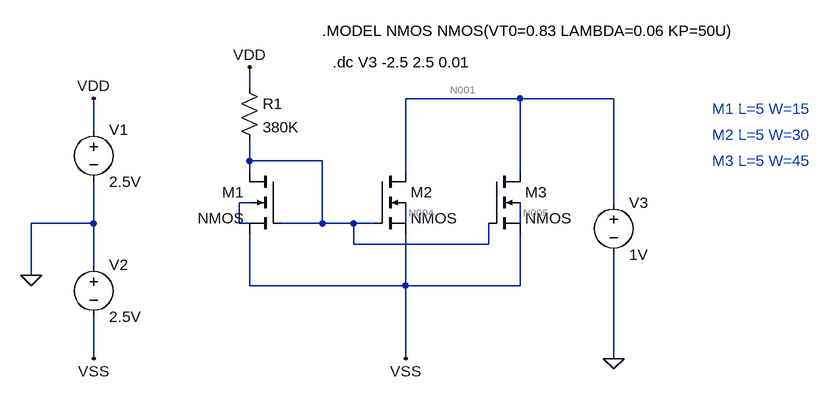
[diagram p0: schematic Cascaded.asc]
Cascaded.asc, the LTspice schematic file:
Version 4
SHEET 1 880 680
WIRE -16 -16 -16 -48
WIRE 400 0 224 0
WIRE 544 0 400 0
WIRE -256 48 -256 0
WIRE -16 96 -16 64
WIRE 96 96 -16 96
WIRE -16 112 -16 96
WIRE 224 112 224 0
WIRE 400 112 400 0
WIRE -16 160 -32 160
WIRE 544 160 544 0
WIRE -256 192 -256 128
WIRE -256 192 -352 192
WIRE -32 192 -32 160
WIRE -16 192 -32 192
WIRE 96 192 96 96
WIRE 96 192 32 192
WIRE 144 192 96 192
WIRE 176 192 144 192
WIRE 224 192 224 160
WIRE 400 192 400 160
WIRE 144 224 144 192
WIRE 352 224 352 192
WIRE 352 224 144 224
WIRE -256 256 -256 192
WIRE -352 272 -352 192
WIRE -16 288 -16 208
WIRE 224 288 224 208
WIRE 224 288 -16 288
WIRE 400 288 400 208
WIRE 400 288 224 288
WIRE -256 400 -256 336
WIRE 224 400 224 288
WIRE 544 400 544 240
FLAG -352 272 0
FLAG 544 400 0
FLAG -256 0 VDD
FLAG -16 -48 VDD
FLAG -256 400 VSS
FLAG 224 400 VSS
SYMBOL nmos4 352 112 R0
SYMATTR InstName M3
SYMATTR Value2 l=5 w=45
SYMBOL nmos4 32 112 M0
SYMATTR InstName M1
SYMATTR Value2 l=5 w=15
SYMBOL voltage -256 32 R0
WINDOW 123 0 0 Left 2
WINDOW 39 0 0 Left 2
SYMATTR InstName V1
SYMATTR Value 2.5V
SYMBOL voltage -256 240 R0
WINDOW 123 0 0 Left 2
WINDOW 39 0 0 Left 2
SYMATTR InstName V2
SYMATTR Value 2.5V
SYMBOL voltage 544 144 R0
WINDOW 123 0 0 Left 2
WINDOW 39 0 0 Left 2
SYMATTR InstName V3
SYMATTR Value 1V
SYMBOL res -32 -32 R0
SYMATTR InstName R1
SYMATTR Value 380K
SYMBOL nmos4 176 112 R0
SYMATTR InstName M2
SYMATTR Value2 l=5 w=30
TEXT 96 -104 Left 2 !.MODEL NMOS NMOS(VT0=0.83 LAMBDA=0.06 KP=50U)
TEXT 112 -56 Left 2 !.dc V3 -2.5 2.5 0.01
TEXT 696 16 Left 2 ;M1 L=5 W=15
TEXT 696 56 Left 2 ;M2 L=5 W=30
TEXT 696 96 Left 2 ;M3 L=5 W=45

The netlist it stands for:
* Cascaded.asc
M3 N001 N002 VSS N005 NMOS l=5 w=45
M1 N002 N002 VSS N003 NMOS l=5 w=15
V1 VDD 0 2.5V
V2 0 VSS 2.5V
V3 N001 0 1V
R1 VDD N002 380K
M2 N001 N002 VSS N004 NMOS l=5 w=30
.model NMOS NMOS
.model PMOS PMOS
.lib standard.mos
.MODEL NMOS NMOS(VT0=0.83 LAMBDA=0.06 KP=50U)
.dc V3 -2.5 2.5 0.01
* M1 L=5 W=15
* M2 L=5 W=30
* M3 L=5 W=45
.backanno
.end

* Results of the author's LTspice run, read from the files saved beside the schematic
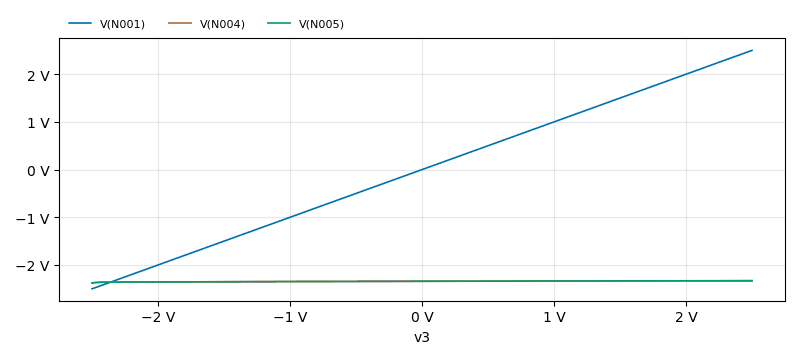
[diagram p1: DC transfer characteristic of Cascaded.asc, plotted from the saved traces]
* DC transfer characteristic, 1 run:
*   V(N001): -2.5 V at v3=-2.5 V, 2.5 V at v3=2.5 V, min -2.5 V, max 2.5 V
*   V(N004): -2.379 V at v3=-2.5 V, -2.331 V at v3=2.5 V, min -2.379 V, max -2.331 V
*   V(N005): -2.379 V at v3=-2.5 V, -2.331 V at v3=2.5 V, min -2.379 V, max -2.331 V